# EAGLE design SparkFun_Qwiic_Micro_Accelerometer_BMA400 (EAGLE 9.6.2)
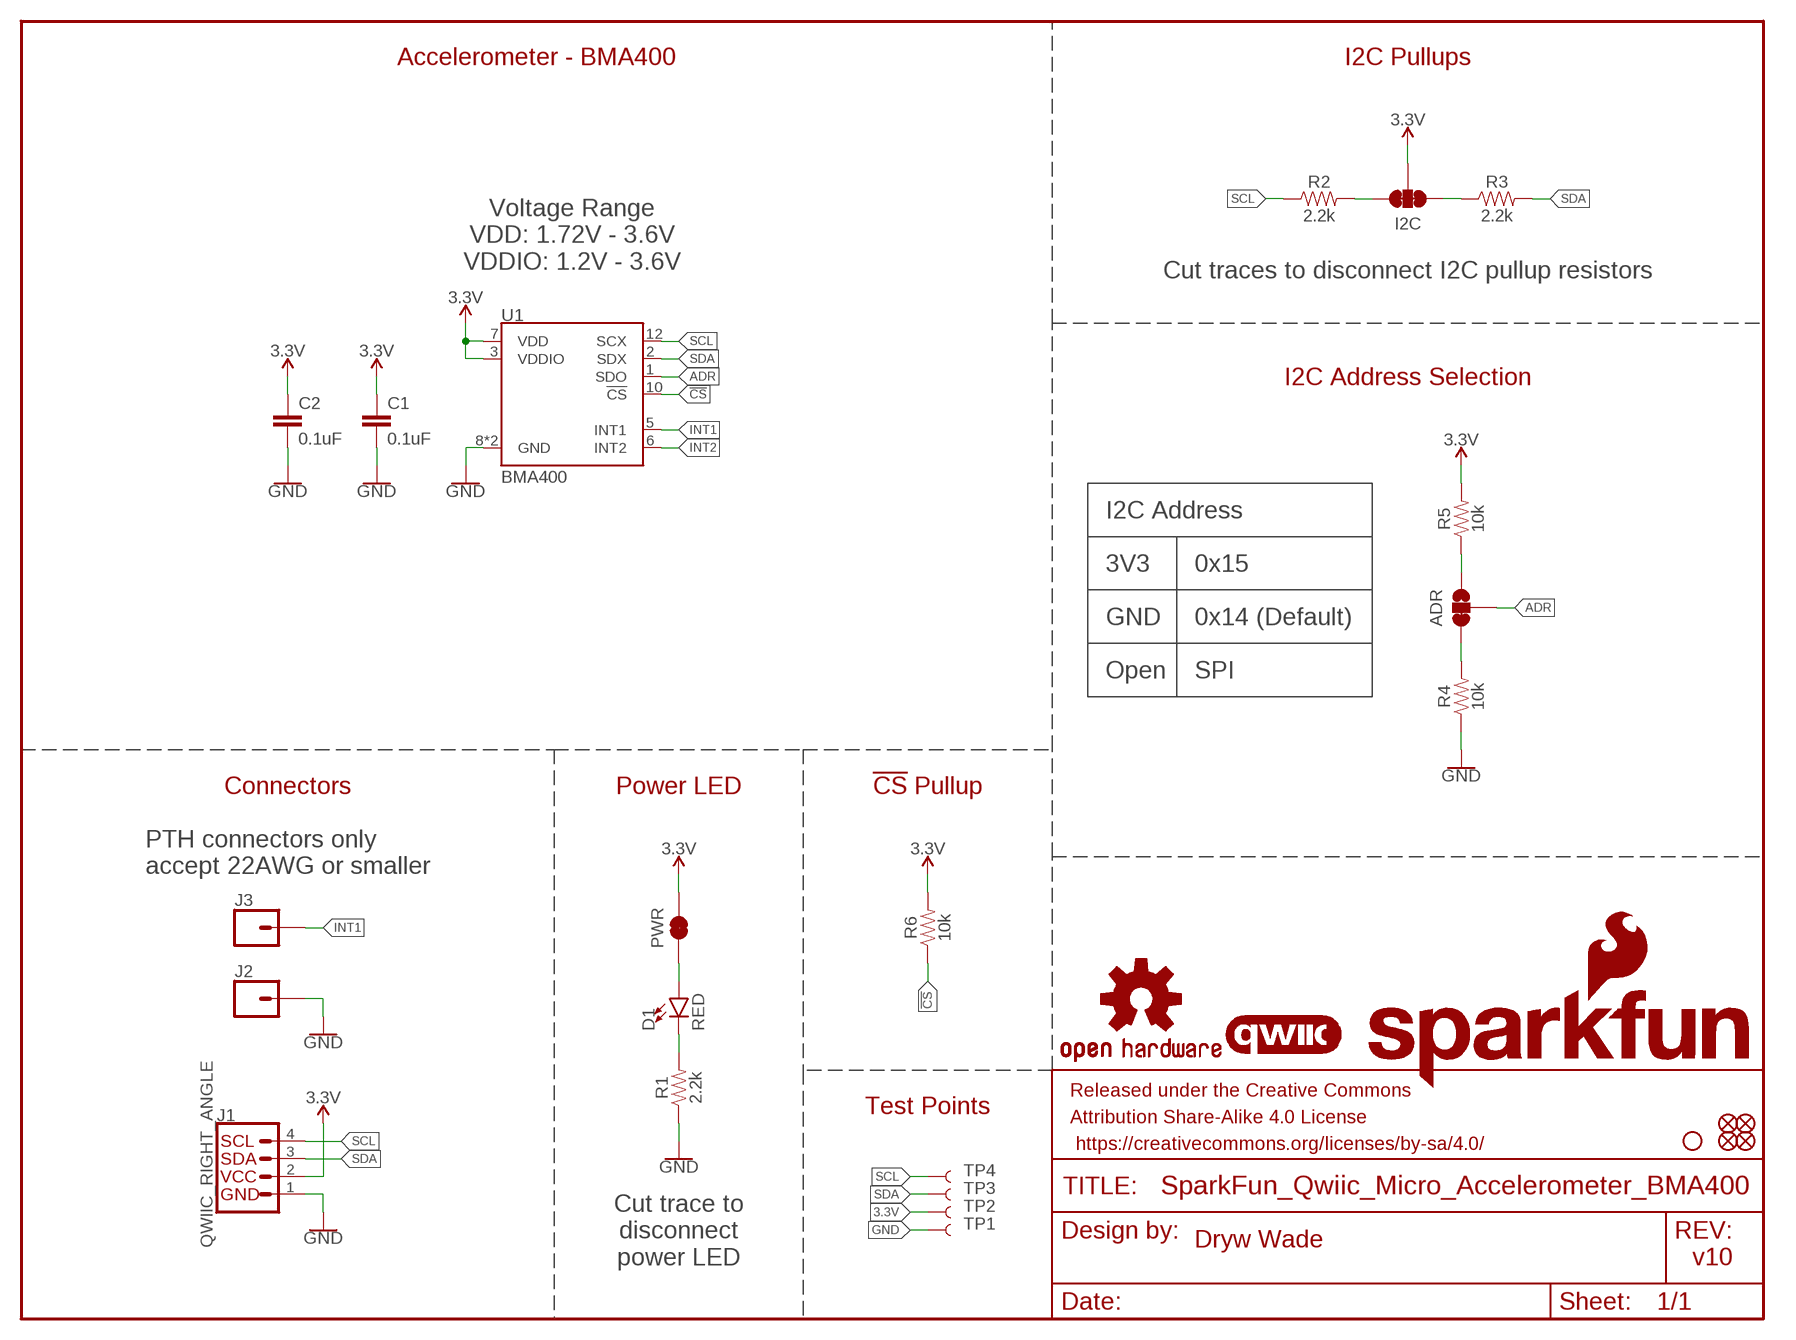
[diagram p0: schematic, sheet 1]

## Parts
ADR  JUMPER-SMT_3_1-NC_TRACE_SILK  [SMT-JUMPER_3_1-NC_TRACE_SILK]
C1  0.1uF  0.1UF-0402T-16V-10%  [0402-TIGHT]
C2  0.1uF  0.1UF-0402T-16V-10%  [0402-TIGHT]
D1  RED  LED-RED_0402  [LED-0402]
FD1  FIDUCIALUFIDUCIAL  [FIDUCIAL-MICRO]
FD2  FIDUCIALUFIDUCIAL  [FIDUCIAL-MICRO]
FD3  FIDUCIALUFIDUCIAL  [FIDUCIAL-MICRO]
FD4  FIDUCIALUFIDUCIAL  [FIDUCIAL-MICRO]
FRAME1  FRAME-LETTER  [CREATIVE_COMMONS]
H1  STAND-OFF  [STAND-OFF]
I2C  JUMPER-SMT_3_2-NC_TRACE_SILK  [SMT-JUMPER_3_2-NC_TRACE_SILK]
J1  QWIIC_RIGHT_ANGLE  QWIIC_CONNECTORJS-1MM  [JST04_1MM_RA]
J2  CONN_01_1MM  [1X01_1MM_NO_SILK]
J3  CONN_01_1MM  [1X01_1MM_NO_SILK]
LOGO1  QWIIC_LOGO_3MM  [QWIIC_3MM]
LOGO2  SFE_LOGO_NAMEBLANK  [BLANK]
LOGO3  OSHW-LOGOS  [OSHW-LOGO-S]
LOGO4  SFE_LOGO_FLAME.1_INCH  [SFE_LOGO_FLAME_.1]
PWR  JUMPER-SMT_2_NC_TRACE_SILK  [SMT-JUMPER_2_NC_TRACE_SILK]
R1  2.2k  2.2KOHM-0402T-1/16W-1%  [0402-TIGHT]
R2  2.2k  2.2KOHM-0402T-1/16W-1%  [0402-TIGHT]
R3  2.2k  2.2KOHM-0402T-1/16W-1%  [0402-TIGHT]
R4  10k  10KOHM-0402T-1/16W-1%  [0402-TIGHT]
R5  10k  10KOHM-0402T-1/16W-1%  [0402-TIGHT]
R6  10k  10KOHM-0402T-1/16W-1%  [0402-TIGHT]
TP1  TEST-POINT3  [PAD.03X.03]
TP2  TEST-POINT3  [PAD.03X.03]
TP3  TEST-POINT3  [PAD.03X.03]
TP4  TEST-POINT3  [PAD.03X.03]
U1  BMA400  [BMA400]

## Nets
3.3V: C1.1 C2.1 I2C.2 J1.2 PWR.2 R5.2 R6.2 TP2.1 U1.3(VDDIO) U1.7(VDD)
!CS!: R6.1 U1.10(!CS!)
ADR: ADR.2 U1.1(SDO)
GND: C1.2 C2.2 J1.1 J2.1 R1.1 R4.1 TP1.1 U1.8(GND) U1.9(GND)
INT1: J3.1 U1.5(INT1)
INT2: U1.6(INT2)
N$1: D1.A PWR.1
N$2: D1.C R1.2
N$3: I2C.3 R2.2
N$4: I2C.1 R3.1
N$5: ADR.1 R5.1
N$6: ADR.3 R4.2
SCL: J1.4 R2.1 TP4.1 U1.12(SCX)
SDA: J1.3 R3.2 TP3.1 U1.2(SDX)

## Notes on the sheet
- Accelerometer - BMA400 | I2C Pullups
- Voltage Range
  VDD: 1.72V - 3.6V
  VDDIO: 1.2V - 3.6V
- Cut traces to disconnect I2C pullup resistors
- I2C Address Selection
- I2C Address
- 3V3 | 0x15
- GND | 0x14 (Default)
- Open | SPI
- Connectors | Power LED | !CS! Pullup
- PTH connectors only
  accept 22AWG or smaller
- Test Points
- Cut trace to
  disconnect
  power LED
- Dryw Wade
- v10

## Library data of the parts
ADR = SparkFun-Jumpers:JUMPER-SMT_3_1-NC_TRACE: Normally closed trace jumper (1 of 2 connections) This jumper has a trace between two pads so it's normally closed (NC). The other connection is normally open (NO). Use a razor knife to open the connection. For best results follow the IPC guidelines for cutting traces: Cutout at least 0.063 mm (0.005 in). Remove all loose material to clean up the cut area. Seal the cut with an approved epoxy. Reapply solder to reclose the connection, or to close the NO connection.
C1 C2 = SparkFun-Capacitors:0.1UF: 0.1µF ceramic capacitors A capacitor is a passive two-terminal electrical component used to store electrical energy temporarily in an electric field.; PROD_ID: CAP-12416
D1 = SparkFun-LED:LED-RED: Red SMD LED Used in manufacturing of most products at SparkFun Packages: 0603 - SMD 0603 package [Product Link] <http://docs.avagotech.com/docs/AV02-0551EN> 0603 SMART - SMD 0603 SMART package ( more efficient and expensive)[Product Link] <http://www.osram-os.com/Graphics/XPic2/00077099_0.pdf> 1206 - SMD1206 package [Product Link] <https://www.sparkfun.com/datasheets/DevTools/LilyPad/Q150OVS4.pdff> SparkFun Products: Pro Mini 328 -5V <https://www.sparkfun.com/products/821> RedBoard <https://www.sparkfun.com/products/12757> IOIO-OTG <https://www.sparkfun.com/products/13613>; PROD_ID: DIO-16757
FD1-FD4 = SparkFun-Aesthetics:FIDUCIAL: Fiducial Alignment Points Point-of-reference for pick-and-place machines and other optical instruments.
FRAME1 = SparkFun-Aesthetics:FRAME-LETTER: Schematic Frame - Letter Standard 8.5x11 US Letter frame
H1 = SparkFun-Hardware:STAND-OFF: Stand Off Drill holes for mechanically mounting via screws, standoffs, etc. Note: Use the keepout ring to avoid running the screw head into surrounding components. Variant Overviews STAND-OFF - Mechanical footprint for a #4 phillips button head screw. STAND-OFF-TIGHT - Mechanical footprint for a #4 phillips button head screw, Example SparkFun Products Screw - Phillips Head (1/4", 4-40, 10 pack) <https://www.sparkfun.com/products/10453> (PRT-10453) Screw - Phillips Head (1/2", 4-40, 10 pack) <https://www.sparkfun.com/products/10452> (PRT-10452) Screw - Phillips Head (3/4", 4-40, 10 pack) <https://www.sparkfun.com/products/10451> (PRT-10451) Screw - Phillips Head (1", 4-40, 10 pack) <https://www.sparkfun.com/products/10450> (PRT-10450)
I2C = SparkFun-Jumpers:JUMPER-SMT_3_2-NC_TRACE: Normally closed trace jumper (2 of 2 connections) This jumper has a trace between all three pads so they are normally closed (NC). Use a razor knife to open the connection(s). For best results follow the IPC guidelines for cutting traces: Cutout at least 0.063 mm (0.005 in). Remove all loose material to clean up the cut area. Seal the cut with an approved epoxy. Reapply solder to reclose the connection(s).
J1 = SparkFun-Connectors:QWIIC_CONNECTOR: SparkFun I2C Standard Qwiic Connector An SMD 1mm pitch JST connector makes it easy and quick (get it? Qwiic?) to connect I2C devices to each other. The Qwiic system <http://www.sparkfun.com/qwiic> enables fast and solderless connection between popular platforms and various sensors and actuators. We carry 200mm <https://www.sparkfun.com/products/14204>, 100mm <https://www.sparkfun.com/products/14205>, 50mm <https://www.sparkfun.com/products/14206>, and breadboard friendly <https://www.sparkfun.com/products/14207> Qwiic cables. We also offer 10 pcs strips <https://www.sparkfun.com/products/14323> the SMD connectors.; PROD_ID: CONN-13694
J2 J3 = SparkFun-Connectors:CONN_01: Single connection point. Often used as Generic Header-pin footprint for 0.1 inch spaced/style header connections On any of the 0.1 inch spaced packages, you can populate with these: Break Away Headers - Straight <https://www.sparkfun.com/products/116> (PRT-00116) Break Away Male Headers - Right Angle <https://www.sparkfun.com/products/553> (PRT-00553) Female Headers <https://www.sparkfun.com/products/115> (PRT-00115) Break Away Headers - Machine Pin <https://www.sparkfun.com/products/117> (PRT-00117) Break Away Female Headers - Swiss Machine Pin <https://www.sparkfun.com/products/743> (PRT-00743) This device is also useful as a general connection point to wire up your design to another part of your project. Our various solder wires solder well into these plated through hole pads. Hook-Up Wire - Assortment (Stranded, 22 AWG) <https://www.sparkfun.com/products/11375> (PRT-11375) Hook-Up Wire - Assortment (Solid Core, 22 AWG) <https://www.sparkfun.com/products/11367> (PRT-11367) View the entire wire category on our website here <https://www.sparkfun.com/categories/141> Special notes: SMTSO-256-ET is a "flush mount" nut for a 4-40 screw. We mostly use this on specialty testbeds; it is a nice way to connect hardware to your PCB at an adjustable hieght. Also note, the SNAP packages are for using a snappable style connector. We sell a baggie of snaps and they are also used on two LilyPad designs: Snap Assortment - 30 pack (male and female) <https://www.sparkfun.com/products/11347> (DEV-11347) LilyPad Arduino SimpleSnap <https://www.sparkfun.com/products/10941> (DEV-10941) LilyPad SimpleSnap Protoboard <https://www.sparkfun.com/products/10940> (DEV-10940)
LOGO1 = SparkFun-Aesthetics:QWIIC_LOGO: Qwiic Logos for placement on schematic and PCB. The 5.5mm silk logo is best for placing next to Qwiic connector.
LOGO2 = SparkFun-Aesthetics:SFE_LOGO_NAME: SparkFun Font Logo This is the SparkFun name logo. The logo on the schematic will always be the same size; the package variant is the height of the flame part of the logo (or the height the flame would be, if it were drawn). Default layer for the logo on the board is tSilk.
LOGO3 = SparkFun-Aesthetics:OSHW-LOGO: Open-Source Hardware (OSHW) Logo This logo indicates the piece of hardware it is found on incorporates a OSHW license and/or adheres to the definition of open source hardware found here: http://freedomdefined.org/OSHW
LOGO4 = SparkFun-Aesthetics:SFE_LOGO_FLAME: SparkFun Flame Logo This is the SparkFun flame logo. The logo on the schematic will always be the same size; the package variant is the height of the flame. Default layer for the logo on the board is tSilk.
PWR = SparkFun-Jumpers:JUMPER-SMT_2_NC_TRACE: Normally closed trace jumper This jumper has a trace between two pads so it's normally closed (NC). Use a razor knife to open the connection. For best results follow the IPC guidelines for cutting traces: Cutout at least 0.063 mm (0.005 in). Remove all loose material to clean up the cut area. Seal the cut with an approved epoxy. Reapply solder to reclose the connection.
R1-R3 = SparkFun-Resistors:2.2KOHM: 2.2kΩ resistor A resistor is a passive two-terminal electrical component that implements electrical resistance as a circuit element. Resistors act to reduce current flow, and, at the same time, act to lower voltage levels within circuits. - Wikipedia; PROD_ID: RES-14341
R4-R6 = SparkFun-Resistors:10KOHM: 10kΩ resistor A resistor is a passive two-terminal electrical component that implements electrical resistance as a circuit element. Resistors act to reduce current flow, and, at the same time, act to lower voltage levels within circuits. - Wikipedia; PROD_ID: RES-14241
TP1-TP4 = SparkFun-Connectors:TEST-POINT: SparkFun Test Points Bare copper test points for troubleshooting or In-Circuit-Testing. These are used by our Production team for verifying production board runs using pogo-pins on test beds. SparkFun Products: SparkFun LSM9DS1 Breakout <https://www.sparkfun.com/products/13284> SparkFun PSOC <https://www.sparkfun.com/products/13714> SparkFun Load Cell Amplifier <https://www.sparkfun.com/products/13879>
U1 = SparkFun-Sensors:BMA400: Bosch BMA400 Accelerometer Senses acceleration with 12-bit resolution up to 16g, sends data out over I2C or SPI; PROD_ID: IC-17118

## Board
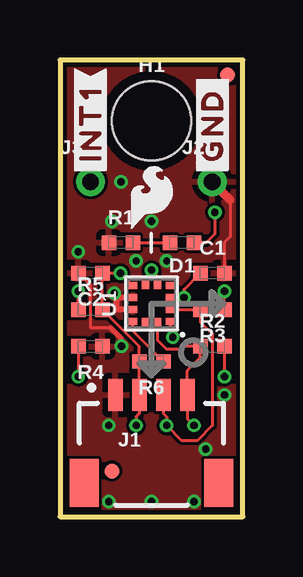
[diagram p1: board, top side]
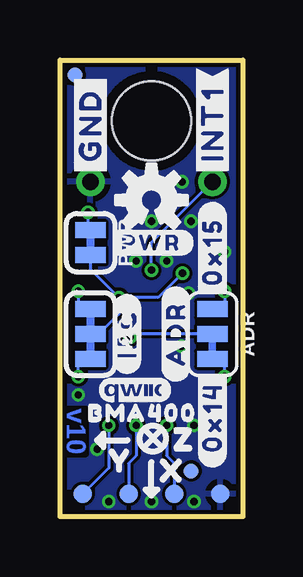
[diagram p2: board, bottom side, seen from below]

Size 7.62 x 19.05 mm. Coordinates in mm from the lower left corner, seen from the top.
Outline: 0,0 7.62,0 7.62,19.05 0,19.05 0,0
Copper layers (1*16): Top 0.035mm / dielectric 1.5mm / Bottom 0.035mm
Design rules "SparkFun-2-Layer-Minimum-JLCPCB": minimum track width 5mil, minimum drill 0.3mm, track to track 5mil, track to pad 5mil, pad to pad 5mil, via to via 5mil, smd to smd 5mil, copper to edge 7mil, drill to drill 7mil, minimum pad ring 5mil, minimum via ring 5mil, stop-mask expansion 2.5mil, vias tented up to drill 25mil, thermal gap 10mil
tRestrict: area 3,8.9 to 3.1,8.9

### Footprints (pad centres in the part's own frame; a part is rotated, then mirrored left to right if it is on the bottom)
SMT-JUMPER_3_1-NC_TRACE_SILK = smd 0.66 x 1.27: 1 -1.041,0; 2 0,0; 3 1.041,0
0402-TIGHT = smd 0.6 x 0.6: 1 -0.5,0; 2 0.5,0
LED-0402 = smd 0.6 x 0.6: A -0.5,0; C 0.5,0
FIDUCIAL-MICRO = smd 0.635 x 0.635: 1 0,0
STAND-OFF = hole 3.302: 0,0
SMT-JUMPER_3_2-NC_TRACE_SILK = smd 0.66 x 1.27: 1 -1.041,0; 2 0,0; 3 1.041,0
JST04_1MM_RA = smd 0.6 x 1.35: 1 -1.5,0; 2 -0.5,0; 3 0.5,0; 4 1.5,0 | smd 1.2 x 2: NC1 2.8,-3.675; NC2 -2.8,-3.675
1X01_1MM_NO_SILK = drill 0.7 pad 1.2: 1 0,0
SMT-JUMPER_2_NC_TRACE_SILK = smd 0.66 x 1.27: 1 -0.521,0; 2 0.521,0
PAD.03X.03 = smd 0.762 x 0.762: 1 0,0
BMA400 = smd 0.3 x 0.35: 1 -0.75,-0.775; 2 -0.25,-0.775; 3 0.25,-0.775; 4 0.75,-0.775; 7 0.75,0.775; 8 0.25,0.775; 9 -0.25,0.775; 10 -0.75,0.775 | smd 0.35 x 0.3: 5 0.775,-0.25; 6 0.775,0.25; 11 -0.775,0.25; 12 -0.775,-0.25

### Placement (x,y rotation side)
ADR  1.27,7.62 270 bottom
C1  6.35,10.16 0 top
C2  1.27,10.16 180 top
D1  5.08,11.43 180 top
FD1  2.16,1.91 0 bottom
FD2  2.16,1.91 0 top
FD3  6.99,18.41 0 top
FD4  6.99,18.41 0 bottom
FRAME1  -19.05,-13.97 0 top  (outside the outline)
H1  3.81,16.51 0 top
I2C  6.35,7.62 270 bottom
J1  3.81,5.08 0 top
J2  6.35,13.97 0 top
J3  1.27,13.97 0 top
LOGO1  4.5,5.28 0 bottom
LOGO2  -19.05,-15.24 0 top  (outside the outline)
LOGO3  3.81,13.21 0 bottom
LOGO4  3.81,13.34 0 top
PWR  6.35,11.43 270 bottom
R1  2.54,11.43 0 top
R2  6.35,7.11 0 top
R3  6.35,8.64 180 top
R4  1.27,7.11 180 top
R5  1.27,8.64 0 top
R6  3.81,6.48 180 top
TP1  0.95,0.95 90 bottom
TP2  2.86,0.95 270 bottom
TP3  4.76,0.95 270 bottom
TP4  6.67,0.95 270 bottom
U1  3.81,8.89 90 top
U$1  [#INT1#0]  1.27,14.1 90 top
U$2  [#GND#0]  6.35,14.1 90 bottom
U$3  [#GND#0]  6.35,14.1 90 top
U$4  [#INT1#0]  1.27,14.1 90 bottom
U$5  [BMA4000]  4.19,4.32 0 bottom
U$6  [X2114]  2.92,1.91 0 bottom
U$7  [#I2C#0]  4.83,7.62 90 bottom
U$8  [#ADR#0]  2.79,7.62 90 bottom
U$9  [#0X15#0]  1.27,9.02 90 bottom
U$10  [#0X14#0]  1.27,6.22 90 bottom
U$11  [#PWR#0]  5.59,11.43 0 bottom
U$12  [Y2115]  5.08,2.34 0 bottom
U$13  [Z2116]  2.44,3.23 0 bottom

### Tracks (layer width: path | path; a pad name or v marks a point on that pad's centre or on a via)
3.3V  (via drill 0.3)
  Top 0.127: v3.17,3.81 3.17,4.17 3.31,4.3 J1.2 R6.2 3.31,7.1 R5.2 C2.1 v2.52,10.16 U1.7 | U1.3 v5.17,9.14 5.17,9.48 C1.1
  Bottom 0.127: v3.17,3.81 3.17,2.54 2.86,2.22 TP2.1 | I2C.2 6,7.62 5.17,8.45 v5.17,9.14 | v5.17,9.14 3.53,9.14 v2.52,10.16 | PWR.2 6.35,10.32 v5.17,9.14
!CS!
  Top 0.127: R6.1 3.04,7.75 U1.10
ADR  (via drill 0.3)
  Top 0.127: U1.1 4.58,7.61 v4.7,7.49
  Bottom 0.127: ADR.2 4.57,7.62 v4.7,7.49
GND  (via drill 0.3)
  Top 0.127: v2.56,7.11 2.56,7.42 | 2.11,7.87 1.27,7.87 1.26,7.88 1.26,9.67 C2.2 | 7.1,13.22 7.1,11.68 6.85,11.43 C1.2
  Top 0.203: 2.56,7.42 2.11,7.87
  Top 0.254: U1.9 2.34,8.64 2.34,9.25 | 2.34,9.25 v2.26,9.32 | 2.34,9.25 2.34,9.32 2.52,9.14 U1.8
  Top 0.356: J2.1 7.1,13.22
  other vias: 2.03,3.81 3.81,0.64 5.59,0.64 2.03,0.64 6.07,2.82 3.17,10.67 4.45,10.67 2.54,13.97 0.76,11.05 6.86,5.08 3.81,12.32 2.16,12.32
  pour Top (isolate 0.127): 0,0 7.62,0 7.62,19.05 0,19.05
  pour Bottom (isolate 0.127): 0,0 7.62,0 7.62,19.05 0,19.05
INT1  (via drill 0.3)
  Top 0.127: U1.5 4.06,10.04 v3.81,10.29
  Bottom 0.127: v3.81,10.29 3.81,11.43 J3.1
N$1  (via drill 0.3)
  Top 0.127: v6.45,12.7 6.45,11.79 6.09,11.43 D1.A
  Bottom 0.127: PWR.1 6.45,12.05 v6.45,12.7
N$2
  Top 0.127: R1.2 D1.C
N$3  (via drill 0.3)
  Top 0.127: R2.2 v6.85,5.85 v6.86,5.84
  Bottom 0.127: v6.86,5.84 6.86,6.58 I2C.3
N$4  (via drill 0.3)
  Top 0.127: R3.1 v6.85,9.39 v6.86,9.4
  Bottom 0.127: v6.86,9.4 6.86,8.66 I2C.1
N$5  (via drill 0.3)
  Top 0.127: R5.1 v0.77,9.39 v0.76,9.4
  Bottom 0.127: v0.76,9.4 0.76,8.66 ADR.1
N$6  (via drill 0.3)
  Top 0.127: R4.2 v0.77,5.85 v0.76,5.84
  Bottom 0.127: v0.76,5.84 0.76,6.58 ADR.3
SCL  (via drill 0.3)
  Top 0.127: v5.59,3.81 5.31,4.09 J1.4 5.31,6.1 5.85,6.64 R2.1 5.09,7.11 4.96,6.99 4.45,6.99 4.06,7.37 U1.12
  Bottom 0.127: v5.59,3.81 5.59,2.03 TP4.1
SDA  (via drill 0.3)
  Top 0.127: J1.3 4.31,4.3 4.45,4.17 v4.45,3.81 5.08,3.17 5.71,3.17 6.35,3.81 6.35,7.63 5.85,8.13 R3.2 U1.2
  Bottom 0.127: v4.45,3.81 4.45,2.54 4.76,2.22 TP3.1

### Text on the board
Bottom: v10
Measures: Units: inches
tDocu: Dryw Wade